# EAGLE design Quad_ESC_adapter (EAGLE 9.5.0)
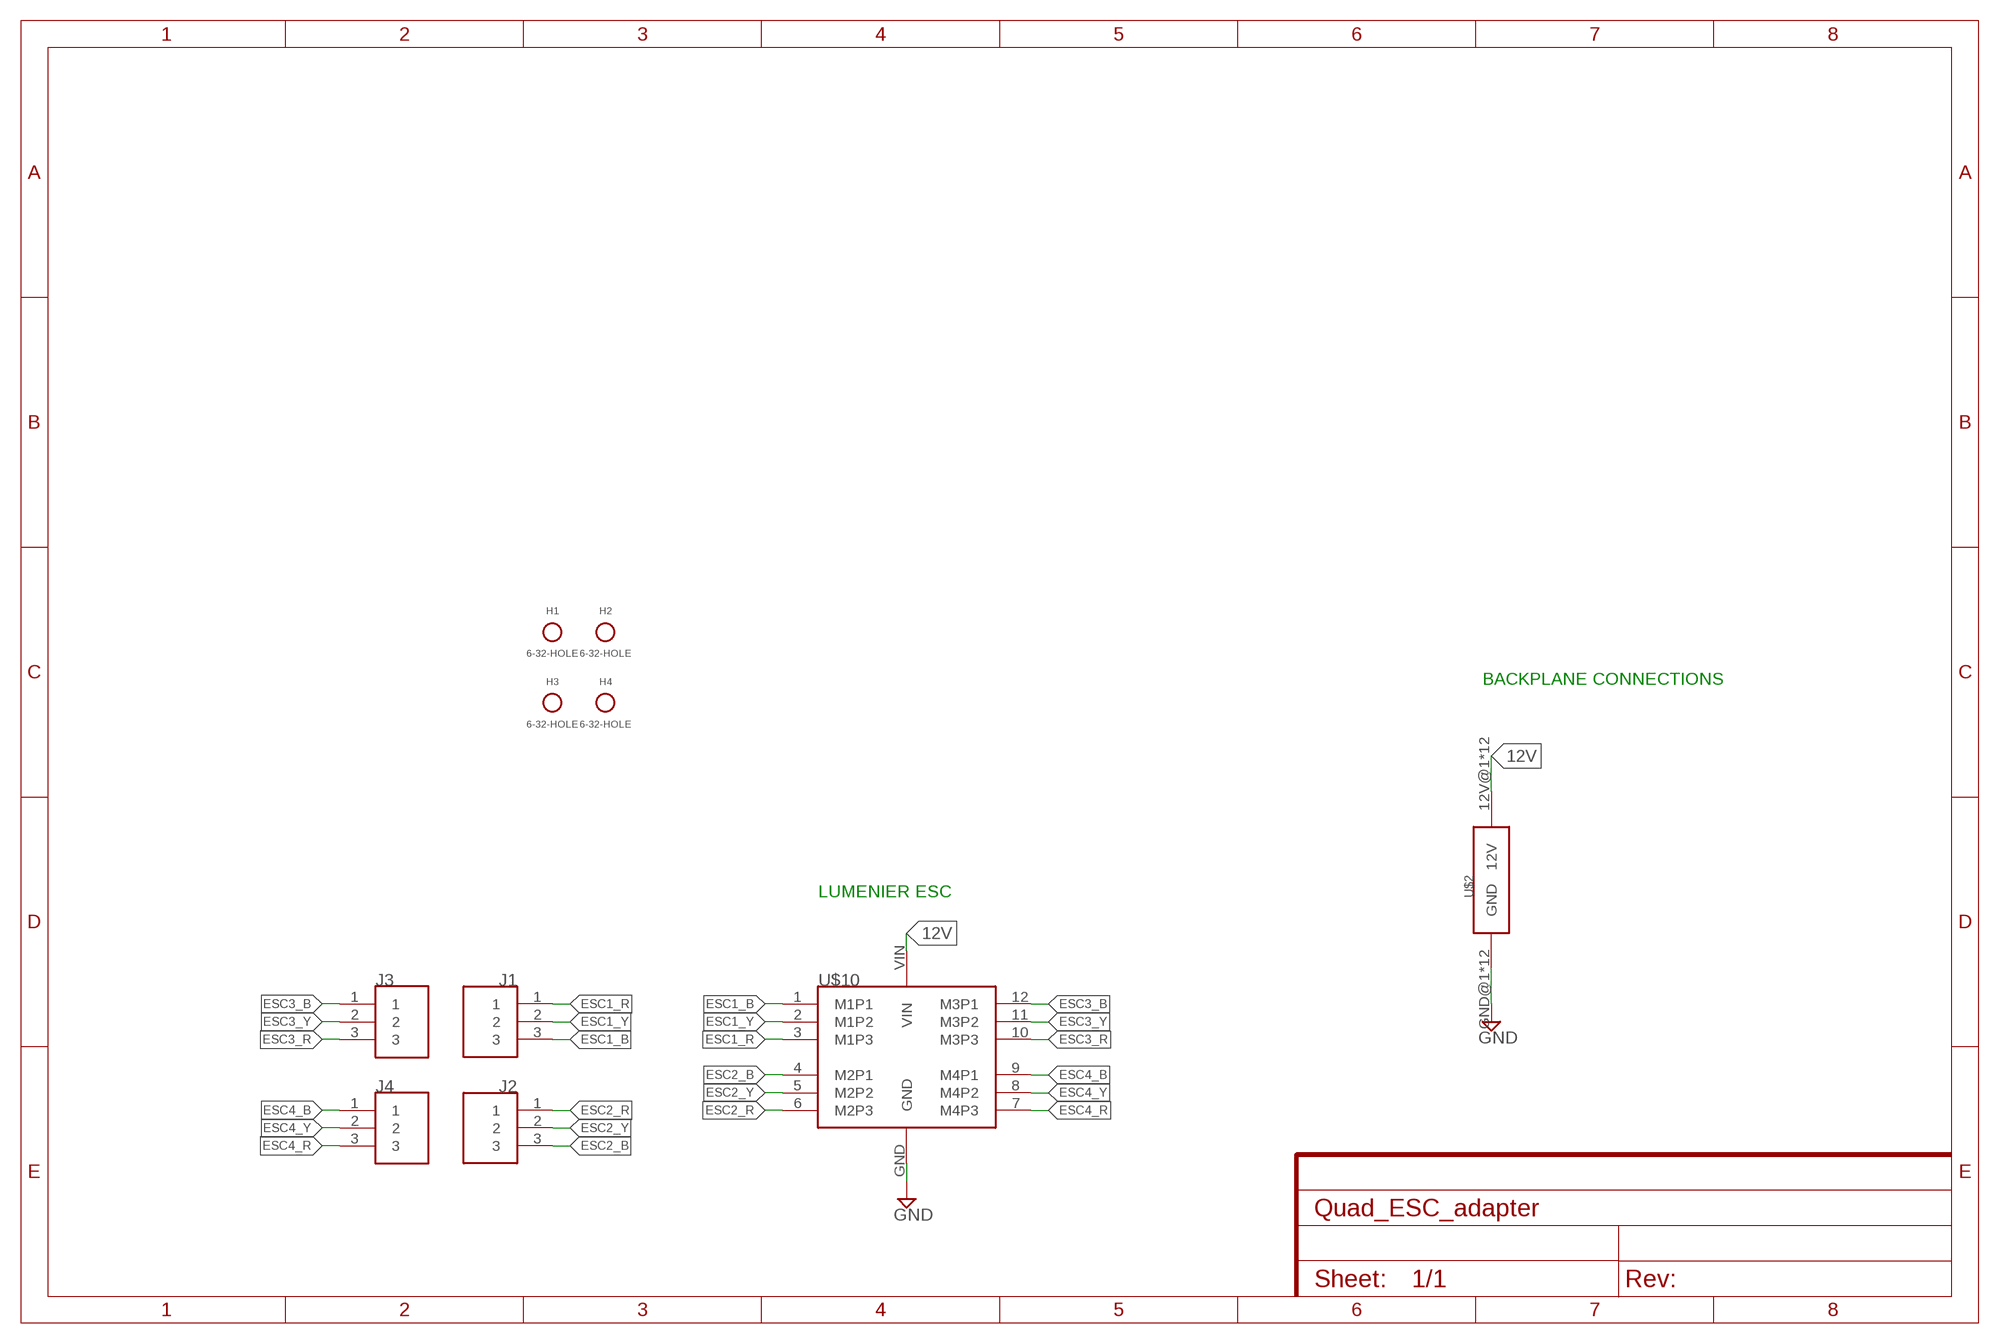
[diagram p0: schematic, sheet 1]

## Parts
H1  6-32-HOLE  [6-32-HOLE]
H2  6-32-HOLE  [6-32-HOLE]
H3  6-32-HOLE  [6-32-HOLE]
H4  6-32-HOLE  [6-32-HOLE]
J1  IBPD-SOCKET  [IPBD-03-S-K]
J2  IBPD-SOCKET  [IPBD-03-S-K]
J3  IBPD-SOCKET  [IPBD-03-S-K]
J4  IBPD-SOCKET  [IPBD-03-S-K]
U$2  BACKPLANE_ESC_ADAPTER_PWRESC  [BACKPLANE_ESC_ADAPTER_ESC_PWR]
U$10  LUMENIER_QUAD-NO-CUT  [LUMENIER_QUAD-NO-CUT]

## Nets
12V: U$2.12V@1(12V) U$2.12V@2(12V) U$2.12V@3(12V) U$2.12V@4(12V) U$2.12V@5(12V) U$2.12V@6(12V) U$2.12V@7(12V) U$2.12V@8(12V) U$2.12V@9(12V) U$2.12V@10(12V) U$2.12V@11(12V) U$2.12V@12(12V) U$10.VIN
ESC1_B: J1.3 U$10.1(M1P1)
ESC1_R: J1.1 U$10.3(M1P3)
ESC1_Y: J1.2 U$10.2(M1P2)
ESC2_B: J2.3 U$10.4(M2P1)
ESC2_R: J2.1 U$10.6(M2P3)
ESC2_Y: J2.2 U$10.5(M2P2)
ESC3_B: J3.1 U$10.12(M3P1)
ESC3_R: J3.3 U$10.10(M3P3)
ESC3_Y: J3.2 U$10.11(M3P2)
ESC4_B: J4.1 U$10.9(M4P1)
ESC4_R: J4.3 U$10.7(M4P3)
ESC4_Y: J4.2 U$10.8(M4P2)
GND: U$2.GND@1(GND) U$2.GND@2(GND) U$2.GND@3(GND) U$2.GND@4(GND) U$2.GND@5(GND) U$2.GND@6(GND) U$2.GND@7(GND) U$2.GND@8(GND) U$2.GND@9(GND) U$2.GND@10(GND) U$2.GND@11(GND) U$2.GND@12(GND) U$10.GND

## Notes on the sheet
- BACKPLANE CONNECTIONS
- LUMENIER ESC

## Library data of the parts
H1-H4 = Mounting Holes:6-32-HOLE
J1-J4 = CONN, IPBD-03-S-K:IBPD-SOCKET
U$2 = Backplane_ESC_adapter:BACKPLANE_ESC_ADAPTER_PWR
U$10 = Lumenier ESC:LUMENIER_QUAD-NO-CUT

## Board
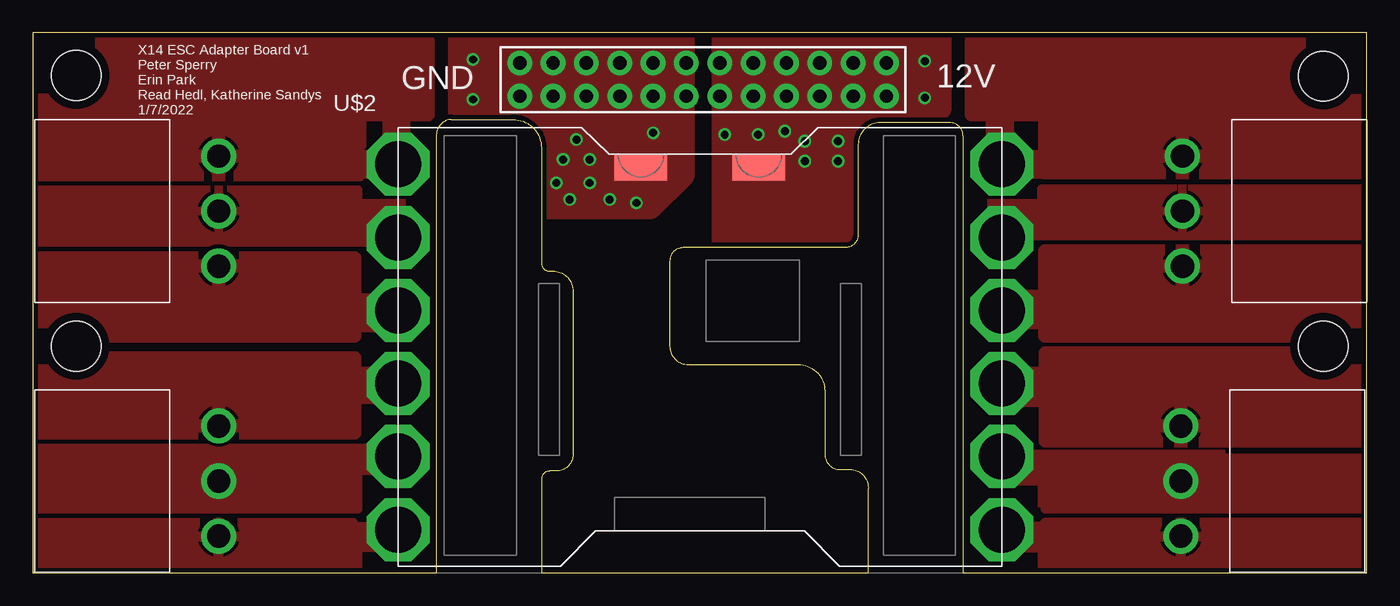
[diagram p1: board, top side]
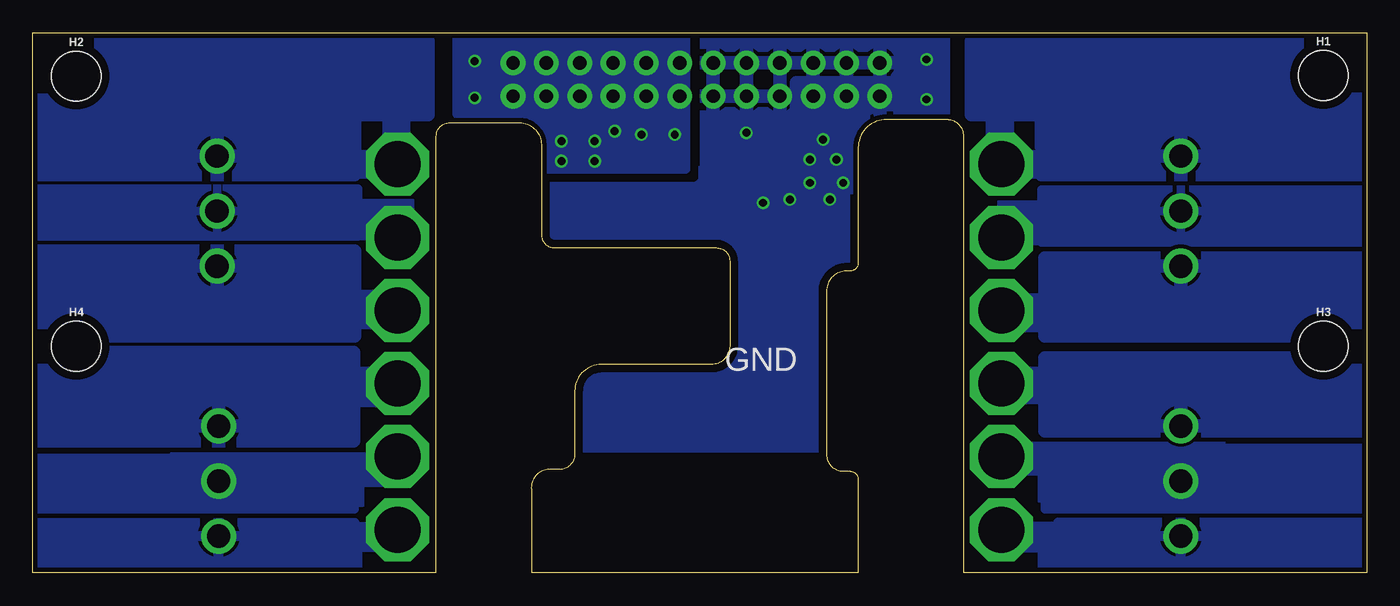
[diagram p2: board, bottom side, seen from below]

Size 101.6 x 41.15 mm. Coordinates in mm from the lower left corner, seen from the top.
Outline: 0,0 30.73,0 30.73,33.27 arc-90 31.88,34.54 36.58,34.54 arc-90 38.73,32.38 38.73,23.62 arc90 39.37,22.99 39.62,22.99 arc-90 41.15,21.46 41.15,9.02 arc-90 39.88,7.75 39.37,7.75 arc90 38.73,7.11 38.73,0 63.63,0 63.63,6.35 arc100 62.1,7.87 61.47,7.87 arc-90 60.33,9.02 60.33,13.84 arc90 58.29,15.88 49.91,15.88 arc-90 48.51,17.27 48.51,23.75 arc-90 49.53,24.77 61.85,24.77 arc90 62.87,25.78 62.87,32.64 arc-90 64.52,34.29 69.85,34.29 arc-90 70.87,33.27 70.87,0 101.6,0 101.6,41.15 0,41.15 0,0
Copper layers (1*16): Top 0.0356mm / dielectric 1.5011mm / Bottom 0.0356mm
Design rules "ECE_Senior_Design *": minimum track width 8mil, minimum drill 13mil, track to track 8mil, track to pad 8mil, pad to pad 6mil, via to via 8mil, smd to smd 6mil, copper to edge 15mil, drill to drill 8mil, minimum pad ring 7mil, minimum via ring 7mil, stop-mask expansion 3mil, vias tented up to drill 30mil, thermal gap 10mil

### Footprints (pad centres in the part's own frame; a part is rotated, then mirrored left to right if it is on the bottom)
6-32-HOLE = hole 3.81: 0,0
IPBD-03-S-K = drill 1.778 pad 2.54: 1 -4.191,-3.747; 2 0,-3.747; 3 4.191,-3.747
BACKPLANE_ESC_ADAPTER_ESC_PWR = drill 1.016 pad 1.88: 12V@1 65.024,36.322; 12V@2 65.024,38.862; 12V@3 62.484,36.322; 12V@4 62.484,38.862; 12V@5 59.944,36.322; 12V@6 59.944,38.862; 12V@7 57.404,36.322; 12V@8 57.404,38.862; 12V@9 54.864,36.322; 12V@10 54.864,38.862; 12V@11 52.324,36.322; 12V@12 52.324,38.862; GND@1 49.784,38.862; GND@2 49.784,36.322; GND@3 47.244,38.862; GND@4 47.244,36.322; GND@5 44.704,38.862; GND@6 44.704,36.322; GND@7 42.164,38.862; GND@8 42.164,36.322; GND@9 39.624,38.862; GND@10 39.624,36.322; GND@11 37.084,38.862; GND@12 37.084,36.322
LUMENIER_QUAD-NO-CUT = drill 3.5 pad 4.8 octagon: 1 0,30.62; 2 0,25.05; 3 0,19.48; 4 0,13.92; 5 0,8.35; 6 0,2.78; 7 46,2.78; 8 46,8.35; 9 46,13.92; 10 46,19.48; 11 46,25.05; 12 46,30.62 | smd 4 x 2: GND 18.51,30.37; VIN 27.49,30.37

### Placement (x,y rotation side)
H1  3.3,37.9 0 bottom
H2  98.3,37.85 0 bottom
H3  3.3,17.27 0 bottom
H4  98.3,17.27 0 bottom
J1  10.41,27.56 90 top
J2  10.41,6.99 90 top
J3  91.31,27.56 270 top
J4  91.19,6.99 270 top
U$2  0,0 0 top
U$10  27.81,0.51 0 top

### Tracks (layer width: path | path; a pad name or v marks a point on that pad's centre or on a via)
12V  (via drill 0.6)
  other vias: 61.34,31.37 58.8,31.37 61.34,32.89 58.8,32.89 52.7,33.4 55.25,33.4 57.28,33.66 67.94,36.2 67.94,38.99
  pour Top (isolate 0.254, no thermals): 52.7,24.26 52.7,44.7 68.96,44.7 68.96,35.43 65.53,35.43 65.53,24.26
  pour Bottom (isolate 0.254, no thermals): 51.82,42.93 69.34,42.93 69.34,34.97 66.11,30.73 51.82,30.73
  pour Top (isolate 0.254): 37.08,25.4 47.42,25.4 50.88,29.46 64.77,29.46 64.77,-0.25 37.08,-0.25
ESC1_B
  pour Bottom (no thermals): 24,32.13 27.56,32.13 27.56,30.1 24,30.1
  pour Bottom (isolate 0.305): -1.78,30.35 24.77,30.35 24.77,34.92 30.1,34.92 30.1,40.51 -1.78,40.51
  pour Bottom (no thermals): 26.92,32.26 26.92,35.81 28.96,35.81 28.96,32.26
  pour Top (isolate 0.305): -3.05,30.35 24.89,30.35 24.89,34.92 30.1,34.92 30.1,40.51 -3.05,40.51
  pour Top (no thermals): 27.3,32.13 23.75,32.13 23.75,30.1 27.3,30.1
  pour Top (no thermals): 28.7,32.26 28.7,35.81 26.67,35.81 26.67,32.26
ESC1_R
  pour Bottom (isolate 0.305): -0.76,18.03 24.51,18.03 24.51,24 -0.76,24
  pour Bottom (no thermals): 22.35,21.21 27.56,21.21 27.56,18.41 22.35,18.41
  pour Top (isolate 0.305): -1.52,18.03 24.51,18.03 24.51,24 -1.52,24
  pour Top (no thermals): 27.69,21.21 22.48,21.21 22.48,18.41 27.69,18.41
ESC1_Y
  pour Bottom (isolate 0.305): -0.76,29.21 24.77,29.21 24.77,25.15 -0.76,25.15
  pour Bottom (no thermals): 23.5,28.32 23.5,25.02 28.07,25.02 28.07,28.32
  pour Top (isolate 0.305): -1.27,29.21 24.77,29.21 24.77,25.15 -1.27,25.15
  pour Top (no thermals): 28.32,28.45 28.32,24.89 23.75,24.89 23.75,28.45
ESC2_B
  pour Bottom (isolate 0.305): 24.51,16.38 -2.29,16.38 -2.29,10.79 24.51,10.79
  pour Bottom (no thermals): 23.24,15.62 27.94,15.62 27.94,12.95 23.24,12.95
  pour Top (isolate 0.305): 24.51,16.38 -3.05,16.38 -3.05,10.67 24.51,10.67
  pour Top (no thermals): 27.81,15.62 23.11,15.62 23.11,12.95 27.81,12.95
ESC2_R
  pour Bottom (isolate 0.305): -0.76,3.81 23.5,3.81 23.5,-0.13 -0.76,-0.13
  pour Bottom (no thermals): 21.21,3.81 28.32,3.81 28.32,1.65 25.02,1.65 25.02,-0.13 21.21,-0.13
  pour Top (isolate 0.305): -1.52,3.81 24.38,3.81 24.38,-0.13 -1.52,-0.13
  pour Top (no thermals): 20.96,3.81 28.07,3.81 28.07,1.65 25.02,1.65 25.02,-0.13 20.96,-0.13
ESC2_Y
  pour Bottom (isolate 0.305): -1.27,9.53 24.51,9.53 24.51,4.83 -1.27,4.83
  pour Bottom (no thermals): 10.8,9.91 27.18,9.91 27.18,7.49 25.02,7.49 25.02,5.46 10.8,5.46
  pour Top (isolate 0.305): -1.27,9.53 24.77,9.53 24.77,4.83 -1.27,4.83
  pour Top (no thermals): 10.54,9.78 27.18,9.78 27.18,7.49 25.02,7.49 25.02,5.46 10.54,5.46
ESC3_B
  pour Bottom (isolate 0.305): 104.65,30.35 77.09,30.35 77.09,34.92 71.5,34.92 71.5,40.51 104.65,40.51
  pour Top (no thermals): 74.68,32.26 74.68,35.81 72.64,35.81 72.64,32.26
  pour Bottom (no thermals): 72.9,32.26 72.9,35.81 74.93,35.81 74.93,32.26
  pour Top (no thermals): 77.6,32.13 74.04,32.13 74.04,30.1 77.6,30.1
  pour Bottom (no thermals): 74.3,32.13 77.85,32.13 77.85,30.1 74.3,30.1
  pour Top (isolate 0.305): 103.38,30.48 77.09,30.48 77.09,34.92 71.5,34.92 71.5,40.51 103.38,40.51
ESC3_R
  pour Top (isolate 0.305): 102.36,18.03 77.09,18.03 77.09,24.51 102.36,24.51
  pour Top (no thermals): 79.25,21.46 74.04,21.46 74.04,18.67 79.25,18.67
  pour Bottom (isolate 0.305): 103.12,18.03 77.09,18.03 77.09,24.51 103.12,24.51
  pour Bottom (no thermals): 73.91,21.46 79.12,21.46 79.12,18.67 73.91,18.67
ESC3_Y
  pour Top (isolate 0.305): 102.36,29.26 76.84,29.26 76.84,25.65 102.36,25.65
  pour Top (no thermals): 78.23,28.45 78.23,25.4 72.77,25.4 72.77,28.45
  pour Bottom (isolate 0.305): 102.87,29.26 76.84,29.26 76.84,25.63 102.87,25.63
  pour Bottom (no thermals): 72.64,28.45 72.64,25.4 77.85,25.4 77.85,28.45
ESC4_B
  pour Top (isolate 0.305): 77.11,16.76 103.89,16.76 103.89,10.06 77.11,10.06
  pour Top (no thermals): 78.36,15.62 73.66,15.62 73.66,12.7 78.36,12.7
  pour Bottom (isolate 0.305): 77.17,16.79 104.65,16.79 104.65,10.06 77.17,10.06
  pour Bottom (no thermals): 73.79,15.62 78.49,15.62 78.49,12.7 73.79,12.7
ESC4_R
  pour Top (isolate 0.305): 102.36,3.81 77.09,3.81 77.09,-0.13 102.36,-0.13
  pour Top (no thermals): 80.39,3.81 73.28,3.81 73.28,1.65 76.58,1.65 76.58,-0.13 80.39,-0.13
  pour Bottom (isolate 0.305): 103.12,3.81 77.09,3.81 77.09,-0.13 103.12,-0.13
  pour Bottom (no thermals): 80.65,3.81 73.53,3.81 73.53,1.65 76.58,1.65 76.58,-0.13 80.65,-0.13
ESC4_Y
  pour Top (isolate 0.305): 102.11,8.76 77.09,8.76 77.09,4.83 102.11,4.83
  pour Top (no thermals): 90.81,9.27 73.91,9.27 73.91,6.73 76.58,6.73 76.58,5.08 90.81,5.08
  pour Bottom (isolate 0.305): 102.87,8.76 77.09,8.76 77.09,4.83 102.87,4.83
  pour Bottom (no thermals): 91.06,9.14 73.91,9.14 73.91,6.6 76.45,6.6 76.45,5.08 91.06,5.08
GND  (via drill 0.6)
  other vias: 47.24,33.53 45.97,28.19 43.94,28.45 40.89,28.45 39.88,29.72 42.42,29.72 42.42,31.5 40.39,31.5 41.4,33.02 33.53,36.07 33.53,39.12
  pour Top (isolate 0.254, no thermals): 32.64,43.81 49.4,43.81 49.4,30.35 46.99,27.94 32.64,27.94
  pour Bottom: 32.26,42.67 50.29,42.67 50.29,29.34 32.26,29.34
  pour Bottom (isolate 0.61, rank 2): 37.34,30.48 61.98,30.48 61.98,9.65 37.34,9.65
  pour Bottom (isolate 0.61, no thermals): 35.05,33.53 35.05,37.34 43.43,37.34 43.43,33.53

### Text on the board
tNames: GND | 12V | X14 ESC Adapter Board v1 / Peter Sperry / Erin Park / Read Hedl, Katherine Sandys / 1/7/2022
bNames: GND